# Altium schematic sheet AD_POWER.SchDoc
size A3
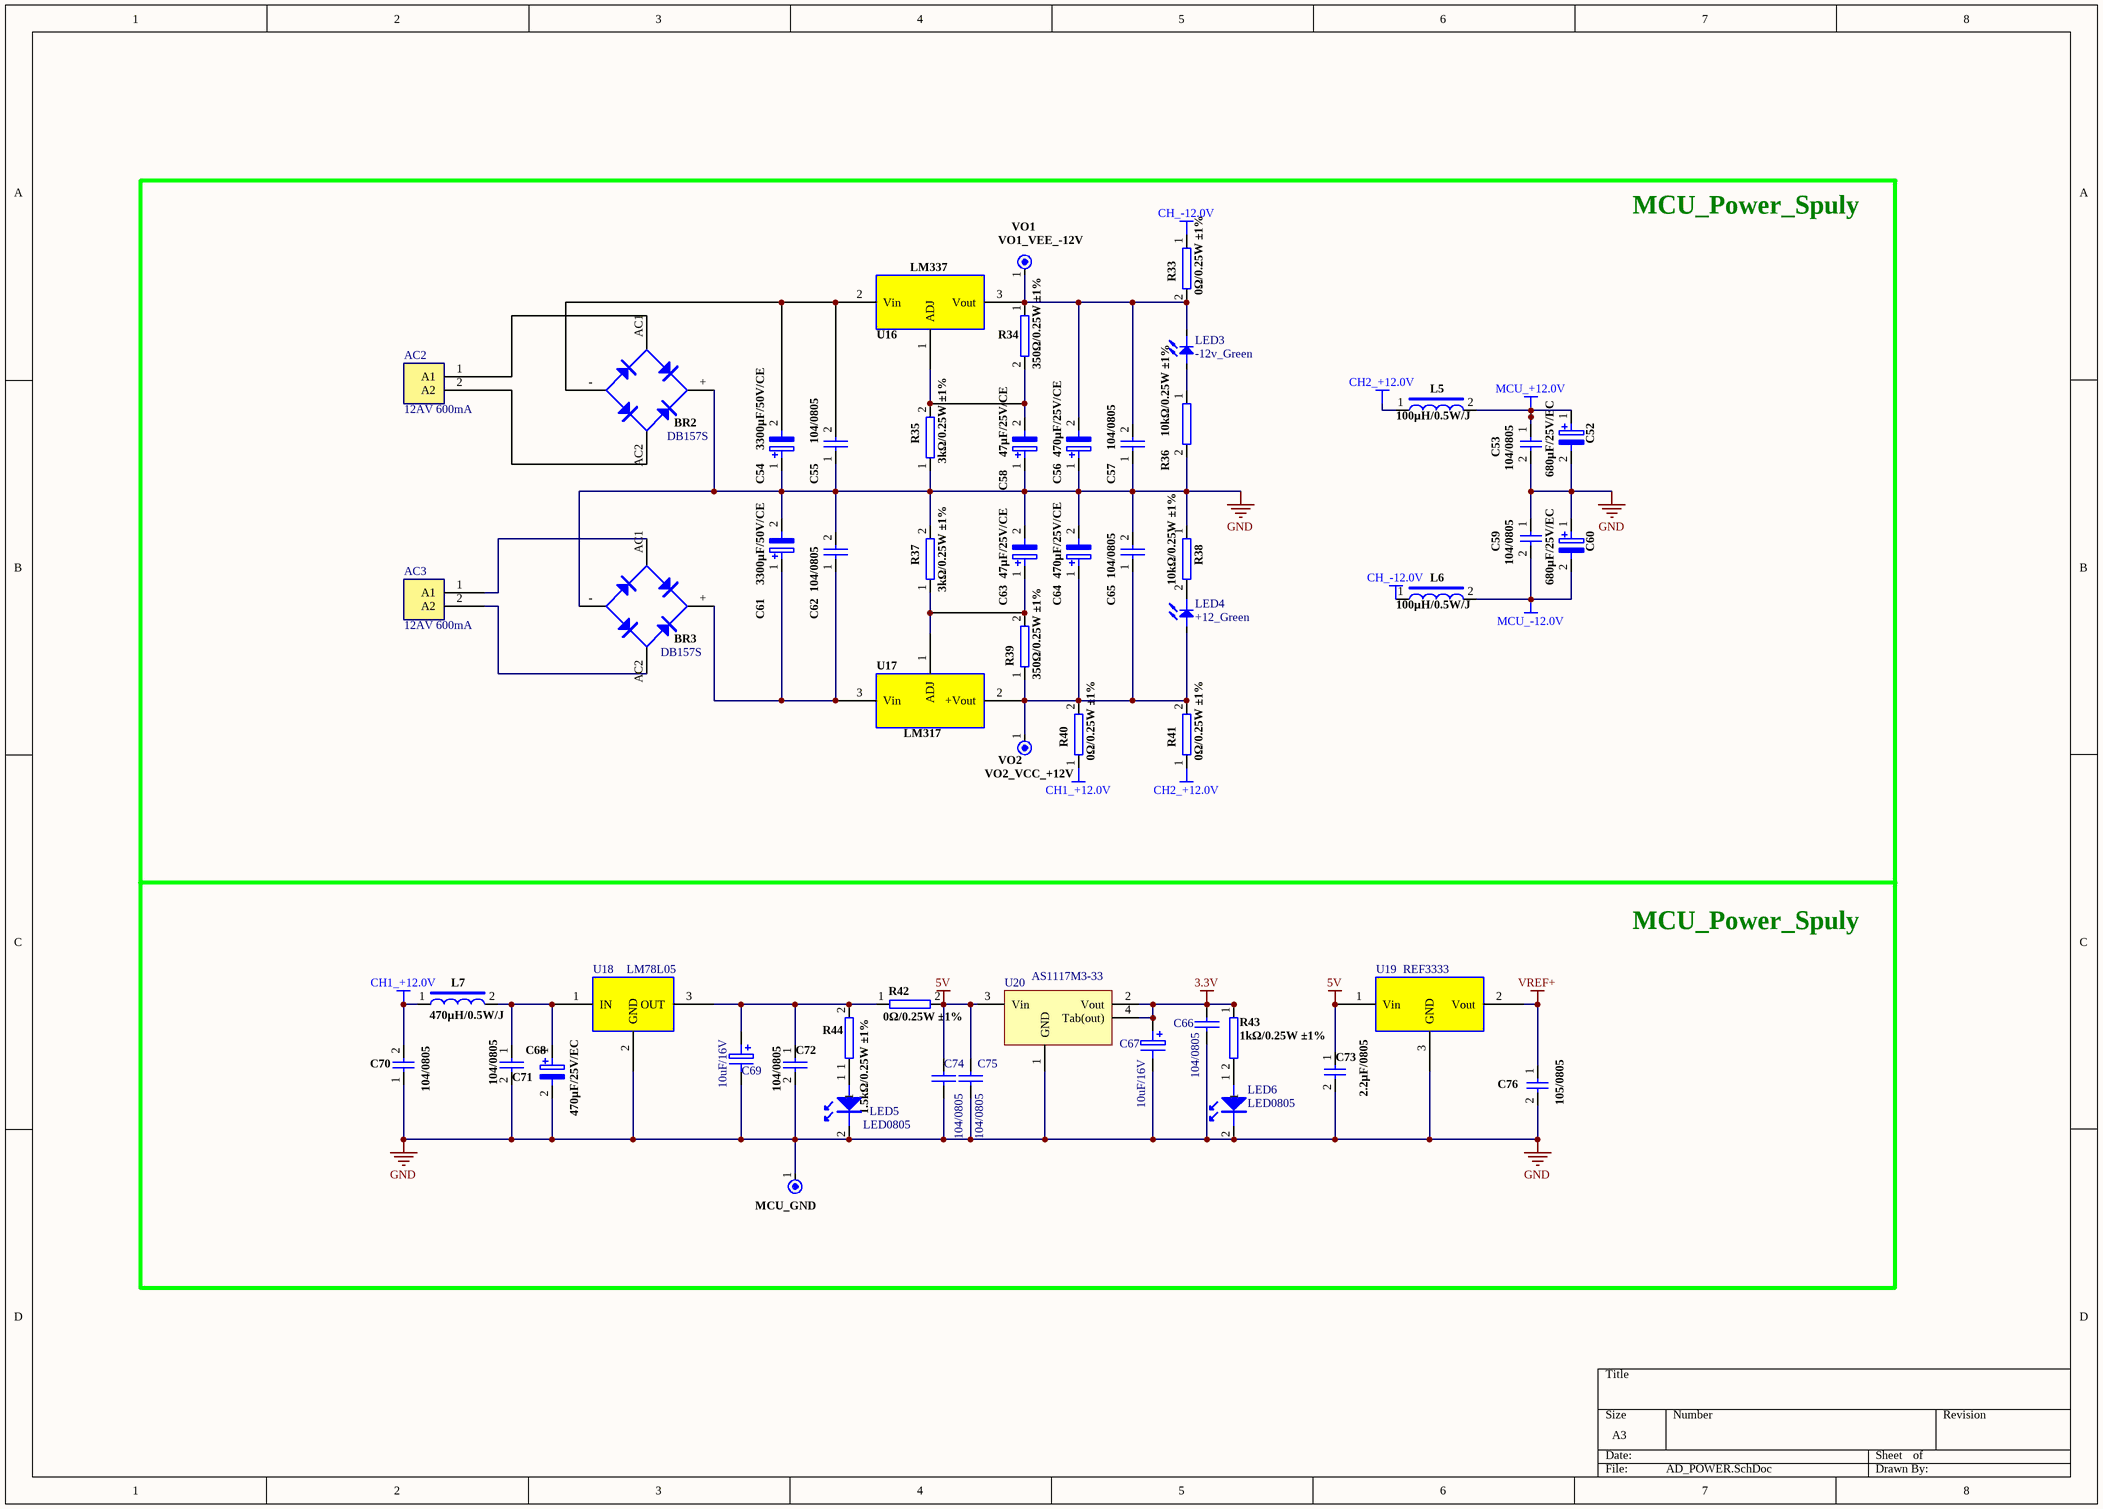
[diagram p0: AD_POWER.SchDoc]

## Parts
AC2  12AV 600mA  [HEADER2]
AC3  12AV 600mA  [HEADER2]
BR2  DB157S  [DB157S]
BR3  DB157S  [DB157S]
C52  680μF/25V/EC  [RB.2/.4]
C53  104/0805  [C0805]
C54  3300μF/50V/CE  [RB.3/.6]
C55  104/0805  [C0805]
C56  470μF/25V/CE  [RB.2/.4]
C57  104/0805  [C0805]
C58  47μF/25V/CE  [RB.1/.2]
C59  104/0805  [C0805]
C60  680μF/25V/EC  [RB.2/.4]
C61  3300μF/50V/CE  [RB.3/.6]
C62  104/0805  [C0805]
C63  47μF/25V/CE  [RB.1/.2]
C64  470μF/25V/CE  [RB.2/.4]
C65  104/0805  [C0805]
C66  104/0805  [C0805]
C67  10uF/16V  [C3216]
C68  470μF/25V/EC  [RB.2/.4]
C69  10uF/16V  [C3216]
C70  104/0805  [C0805]
C71  104/0805  [C0805]
C72  104/0805  [C0805]
C73  2.2μF/0805  [C0805]
C74  104/0805  [C0805]
C75  104/0805  [C0805]
C76  105/0805  [C0805]
L5  100μH/0.5W/J  [AXIAL0.4]
L6  100μH/0.5W/J  [AXIAL0.4]
L7  470μH/0.5W/J  [AXIAL0.4]
LED3  -12v_Green  [LED_0805]
LED4  +12_Green  [LED_0805]
LED5  LED0805  [LED_0805]
LED6  LED0805  [LED_0805]
MCU_GND1  MCU_GND  [TESTSMD]
R33  0Ω/0.25W ±1%  [R0805]
R34  350Ω/0.25W ±1%  [R0805]
R35  3kΩ/0.25W ±1%  [R0805]
R36  10kΩ/0.25W ±1%  [R0805]
R37  3kΩ/0.25W ±1%  [R0805]
R38  10kΩ/0.25W ±1%  [R0805]
R39  350Ω/0.25W ±1%  [R0805]
R40  0Ω/0.25W ±1%  [R0805]
R41  0Ω/0.25W ±1%  [R0805]
R42  0Ω/0.25W ±1%  [R0805]
R43  1kΩ/0.25W ±1%  [R0805]
R44  1.5kΩ/0.25W ±1%  [R0805]
U16  LM337  [TO220H]
U17  LM317  [TO220H]
U18  LM78L05  [TO-220]
U19  REF3333  [SOT-23-B]
U20  AS1117M3-33  [SOT-223-3L(M3)]
VO1  VO1_VEE_-12V  [TESTSMD]
VO2  VO2_VCC_+12V  [TESTSMD]

## Nets
3.3V: C66.1 C67.1 R43.1 U20.2(Vout) U20.4(Tab(out))
5V: C73.1 C74.1 C75.1 R42.2 U19.1(Vin) U20.3(Vin)
CH1_+12.0V: C70.2 L7.1 R40.1
CH2_+12.0V: L5.1 R41.1
CH_-12.0V: L6.1 R33.1
GND: BR2.+(V+) BR3.-(V-) C52.2 C53.2 C54.1 C55.1 C56.1 C57.1 C58.1 C59.1 C60.1 C61.2 C62.2 C63.2 C64.2 C65.2 C66.2 C67.2 C68.2 C69.2 C70.1 C71.2 C72.2 C73.2 C74.2 C75.2 C76.2 LED5.2 LED6.2 MCU_GND1.1 R35.1 R36.2 R37.2 R38.1 U18.2(GND) U19.3(GND) U20.1(GND)
MCU_+12.0V: C52.1 C53.1 L5.2
MCU_-12.0V: C59.2 C60.2 L6.2
VREF+: C76.1 U19.2(Vout)
NetAC2_1: AC2.1(A1) BR2.AC1
NetAC2_2: AC2.2(A2) BR2.AC2
NetAC3_1: AC3.1(A1) BR3.AC1
NetAC3_2: AC3.2(A2) BR3.AC2
NetBR2_-: BR2.-(V-) C54.2 C55.2 U16.2(Vin)
NetBR3_+: BR3.+(V+) C61.1 C62.1 U17.3(Vin)
NetC56_2: C56.2 C57.2 LED3.2 R33.2 R34.1 U16.3(Vout) VO1.1
NetC58_2: C58.2 R34.2 R35.2 U16.1(ADJ)
NetC63_1: C63.1 R37.1 R39.2 U17.1(ADJ)
NetC64_1: C64.1 C65.1 LED4.1 R39.1 R40.2 R41.2 U17.2(+Vout) VO2.1
NetC68_1: C68.1 C71.1 L7.2 U18.1(IN)
NetC69_1: C69.1 C72.1 R42.1 R44.2 U18.3(OUT)
NetLED3_1: LED3.1 R36.1
NetLED4_2: LED4.2 R38.2
NetLED5_1: LED5.1 R44.1
NetLED6_1: LED6.1 R43.2

## Notes on the sheet
- MCU_Power_Spuly

## Library data of the parts
AC2 AC3 = CON2: 接线端子 AWG14-22 300VAC 16A 5.0mm HEADER2
BR2 BR3 = NBRIDGE1: 贴片整流桥 DB157S 50A/1000V
C52 C60 = ELECTRO2: 电解电容 680μF/25V/EC ±10% RB.2/.4
C53 C55 C57 C59 C62 C65 C66 C70-C72 C74 C75 = CAP: 贴片电容 104/25V ±1% C0805
  C74 C75: value: *
C54 C61 = ELECTRO2: 电解电容 3300μF/50V ±10% RB.3/.6
C56 C64 = ELECTRO2: 电解电容 470μF/25V/CE ±10% RB.2/.4
C58 C63 = ELECTRO2: 电解电容 47μF/25V ±10% RB.1/.2
C67 C69 = ELECTRO1: 贴片钽电容 10uF/16V ±10% C3216
C68 = ELECTRO2: 电解电容 470μF/25V/EC ±10% RB.2/.4
C73 = CAP: 贴片电容 2.2μF/50V ±1% C0805
C76 = CAP: 贴片电容 105/25V ±1% C0805
L5 L6 = INDUCTOR2: 直插电感 100μH/0.5W/J ±5% AXIAL0.4
L7 = INDUCTOR2: 直插电感 470μH/0.5W ±5% AXIAL0.4
LED3 = B_LED: 贴片LED灯 绿色 2.0V 20mA  LED_0805
LED4 = B_LED: 贴片LED灯 绿色 2.0V 20mA LED_0805
LED5 LED6 = LED0805: 贴片LED灯 蓝色 2.0V 20mA LED_0805
MCU_GND1 VO2 = CON1
R33 R40-R42 = RES2: 贴片电阻 0Ω 0.25W ±1% R0805
R34 R39 = RES2: 贴片电阻 350Ω 0.25W ±1% R0805
R35 R37 = RES2: 贴片电阻 3kΩ 0.25W ±1% R0805
R36 R38 = RES2: 贴片电阻 10kΩ 0.25W ±1% R0805
R43 = RES2: 贴片电阻 1kΩ 0.25W ±1% R0805; Part Field 1: 06-115611-18
R44 = RES2: 贴片电阻 1.5kΩ 0.25W ±1% R0805
U16 = LM337: 线性可调稳压IC LM337 TO220H
U17 = LM317: 线性可调稳压IC  LM317 TO-220H
U18 = LM78L05: 线性稳压芯片 LM78L05 TO-220
U19 = REF33XX: 3.3V电压基准芯片 REF3333 SOT-23-B; 物?: *; 部?: *; 供?: *
U20 = AS1117M3-33: 线性稳压管 AS1117M3-33 SOT-223; 物?: *; 部?: *; 供?: *
VO1 = CON1: 测试点